# Altium project F1C200s-core.PrjPcb
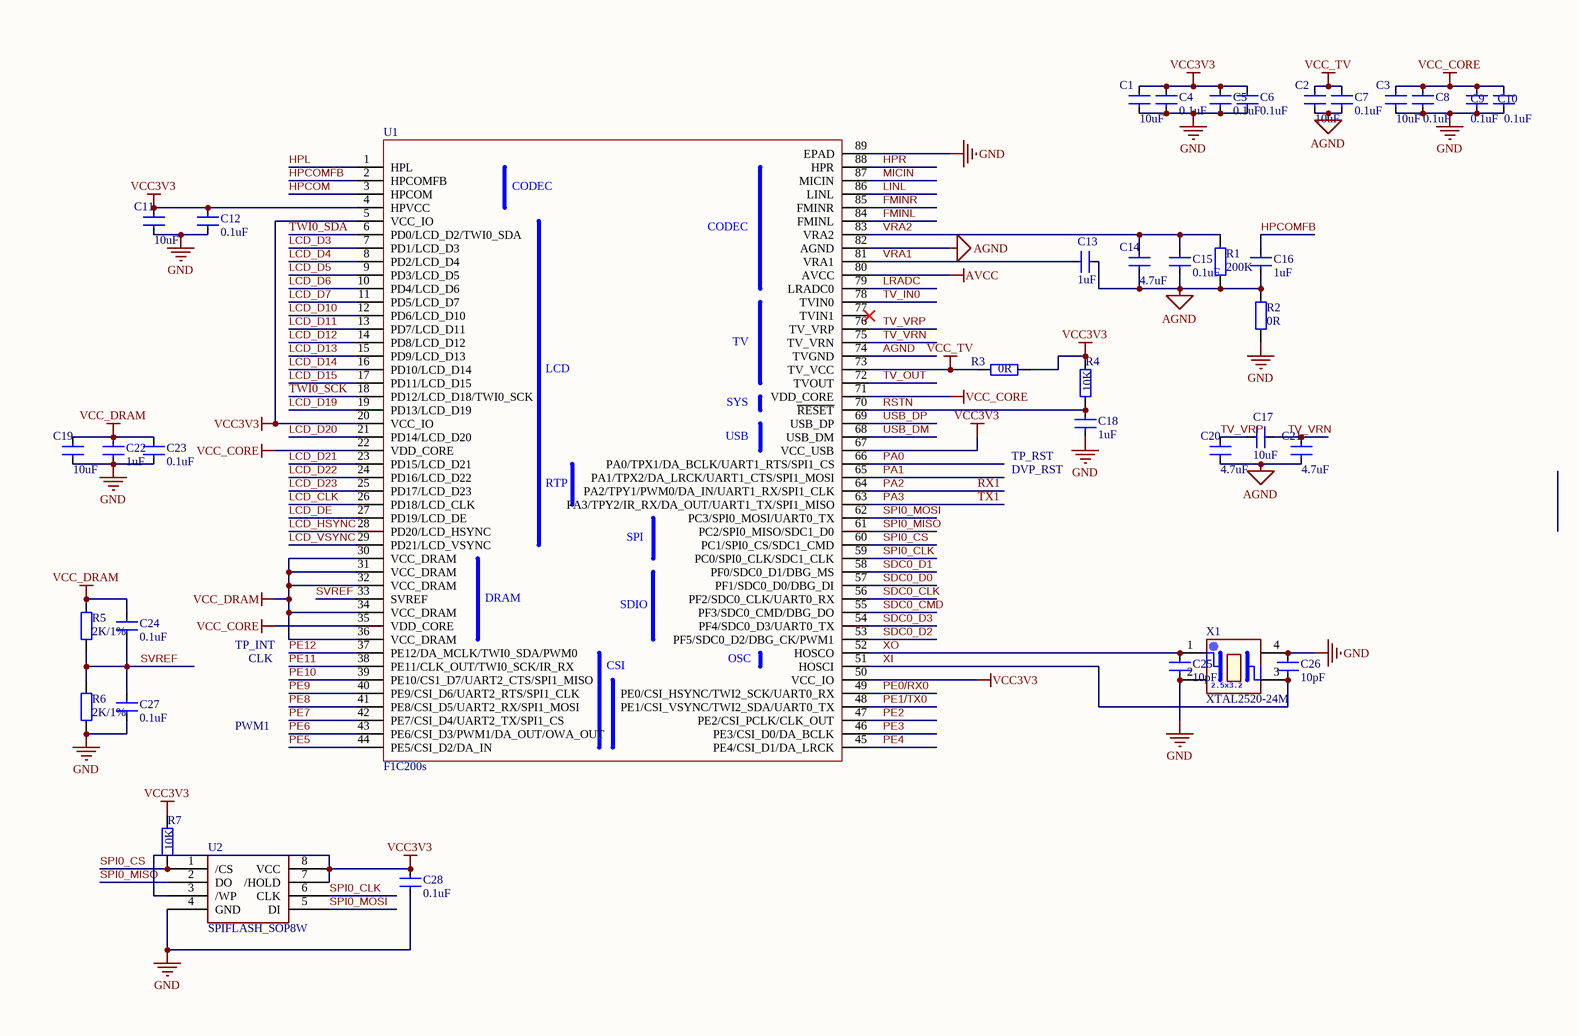
[diagram p0: F200s.SchDoc]
2 sheets, 112 parts. Net scope: global (net labels, ports and power ports of the same name join across sheets).
Board file: core.PcbDoc
Sheets:
  F200s.SchDoc
  Periph.SchDoc

## Sheet F200s.SchDoc: RF
size A4; Date: 20150330; DrawnBy: mango; DocumentNumber: 1; SheetNumber: 1; SheetTotal: 7; CurrentTime: sdfsdfsd

### Parts
C1  10uF  [C0402]
C2  10uF  [C0402]
C3  10uF  [C0402]
C4  0.1uF  [C0402]
C5  0.1uF  [C0402]
C6  0.1uF  [C0402]
C7  0.1uF  [C0402]
C8  0.1uF  [C0402]
C9  0.1uF  [C0402]
C10  0.1uF  [C0402]
C11  10uF  [C0402]
C12  0.1uF  [C0402]
C13  1uF  [C0402]
C14  4.7uF  [C0402]
C15  0.1uF  [C0402]
C16  1uF  [C0402]
C17  10uF  [C0402]
C18  1uF  [C0402]
C19  10uF  [C0402]
C20  4.7uF  [C0402]
C21  4.7uF  [C0402]
C22  1uF  [C0402]
C23  0.1uF  [C0402]
C24  0.1uF  [C0402]
C25  10pF  [C0402]
C26  10pF  [C0402]
C27  0.1uF  [C0402]
C28  0.1uF  [C0402]
R1  200K  [R0402]
R2  0R  [R0402]
R3  0R  [R0402]
R4  10K  [R0402]
R5  2K/1%  [R0402]
R6  2K/1%  [R0402]
R7  10K  [R0402]
U1  F1C200s  [QFN40P1000X1000X85_HS-89N]
U2  SPIFLASH_SOP8W  [WSON-SPIFLASH]
X1  XTAL2520-24M  [XTAL2520]

### Nets
AGND: C2.1 C7.1 C13.2 C14.1 C15.1 C16.2 C20.1 C21.1 R1.1 R2.2 U1.74(TVGND) U1.82(AGND)
AVCC: U1.80(AVCC)
GND: C1.1 C3.1 C4.1 C5.1 C6.1 C8.1 C9.1 C10.1 C11.1 C12.2 C18.2 C19.1 C22.1 C23.1 C25.1 C26.2 C27.1 C28.1 R2.1 R6.1 U1.89(EPAD) U2.4(GND) X1.2(NC1) X1.4(NC2)
VCC3V3: C1.2 C4.2 C5.2 C6.2 C11.2 C12.1 C28.2 R3.1 R4.2 R7.2 U1.4(HPVCC) U1.5(VCC_IO) U1.20(VCC_IO) U1.50(VCC_IO) U1.67(VCC_USB) U2.3(/WP) U2.7(/HOLD) U2.8(VCC)
VCC_CORE: C3.2 C8.2 C9.2 C10.2 U1.22(VDD_CORE) U1.35(VDD_CORE) U1.71(VDD_CORE)
VCC_DRAM: C19.2 C22.2 C23.2 C24.2 R5.2 U1.30(VCC_DRAM) U1.31(VCC_DRAM) U1.32(VCC_DRAM) U1.34(VCC_DRAM) U1.36(VCC_DRAM)
VCC_TV: C2.2 C7.2 R3.2 U1.73(TV_VCC)
FMINL: U1.84(FMINL)
FMINR: U1.85(FMINR)
HPCOM: U1.3(HPCOM)
HPCOMFB: C16.1 U1.2(HPCOMFB)
HPL: U1.1(HPL)
HPR: U1.88(HPR)
LCD_CLK: U1.26(PD18/LCD_CLK)
LCD_D3: U1.7(PD1/LCD_D3)
LCD_D4: U1.8(PD2/LCD_D4)
LCD_D5: U1.9(PD3/LCD_D5)
LCD_D6: U1.10(PD4/LCD_D6)
LCD_D7: U1.11(PD5/LCD_D7)
LCD_D10: U1.12(PD6/LCD_D10)
LCD_D11: U1.13(PD7/LCD_D11)
LCD_D12: U1.14(PD8/LCD_D12)
LCD_D13: U1.15(PD9/LCD_D13)
LCD_D14: U1.16(PD10/LCD_D14)
LCD_D15: U1.17(PD11/LCD_D15)
LCD_D19: U1.19(PD13/LCD_D19)
LCD_D20: U1.21(PD14/LCD_D20)
LCD_D21: U1.23(PD15/LCD_D21)
LCD_D22: U1.24(PD16/LCD_D22)
LCD_D23: U1.25(PD17/LCD_D23)
LCD_DE: U1.27(PD19/LCD_DE)
LCD_HSYNC: U1.28(PD20/LCD_HSYNC)
LCD_VSYNC: U1.29(PD21/LCD_VSYNC)
LINL: U1.86(LINL)
LRADC: U1.79(LRADC0)
MICIN: U1.87(MICIN)
PA0: U1.66(PA0/TPX1/DA_BCLK/UART1_RTS/SPI1_CS)
PA1: U1.65(PA1/TPX2/DA_LRCK/UART1_CTS/SPI1_MOSI)  [project net DVP_RST]
PA2: U1.64(PA2/TPY1/PWM0/DA_IN/UART1_RX/SPI1_CLK)  [also labelled RX1]
PA3: U1.63(PA3/TPY2/IR_RX/DA_OUT/UART1_TX/SPI1_MISO)  [also labelled TX1]
PE0/RX0: U1.49(PE0/CSI_HSYNC/TWI2_SCK/UART0_RX)  [project net DVP_HSYNC]
PE1/TX0: U1.48(PE1/CSI_VSYNC/TWI2_SDA/UART0_TX)  [project net DVP_VSYNC]
PE2: U1.47(PE2/CSI_PCLK/CLK_OUT)  [project net DVP_PCLK]
PE3: U1.46(PE3/CSI_D0/DA_BCLK)  [project net DVP-Y2]
PE4: U1.45(PE4/CSI_D1/DA_LRCK)  [project net DVP-Y3]
PE5: U1.44(PE5/CSI_D2/DA_IN)  [project net DVP-Y4]
PE6: U1.43(PE6/CSI_D3/PWM1/DA_OUT/OWA_OUT)  [project net DVP-Y5]
PE7: U1.42(PE7/CSI_D4/UART2_TX/SPI1_CS)  [project net DVP-Y6]
PE8: U1.41(PE8/CSI_D5/UART2_RX/SPI1_MOSI)  [project net DVP-Y7]
PE9: U1.40(PE9/CSI_D6/UART2_RTS/SPI1_CLK)  [project net DVP-Y8]
PE10: U1.39(PE10/CS1_D7/UART2_CTS/SPI1_MISO)  [project net DVP-Y9]
PE11: U1.38(PE11/CLK_OUT/TWI0_SCK/IR_RX)  [project net DVP_XCLK]
PE12: U1.37(PE12/DA_MCLK/TWI0_SDA/PWM0)
RSTN: C18.1 R4.1 U1.70(~{RESET})
SDC0_CLK: U1.56(PF2/SDC0_CLK/UART0_RX)
SDC0_CMD: U1.55(PF3/SDC0_CMD/DBG_DO)
SDC0_D0: U1.57(PF1/SDC0_D0/DBG_DI)
SDC0_D1: U1.58(PF0/SDC0_D1/DBG_MS)
SDC0_D2: U1.53(PF5/SDC0_D2/DBG_CK/PWM1)
SDC0_D3: U1.54(PF4/SDC0_D3/UART0_TX)
SPI0_CLK: U1.59(PC0/SPI0_CLK/SDC1_CLK) U2.6(CLK)
SPI0_CS: R7.1 U1.60(PC1/SPI0_CS/SDC1_CMD) U2.1(/CS)
SPI0_MISO: U1.61(PC2/SPI0_MISO/SDC1_D0) U2.2(DO)
SPI0_MOSI: U1.62(PC3/SPI0_MOSI/UART0_TX) U2.5(DI)
SVREF: C24.1 C27.2 R5.1 R6.2 U1.33(SVREF)
TV_IN0: U1.78(TVIN0)
TV_OUT: U1.72(TVOUT)
TV_VRN: C17.1 C21.2 U1.75(TV_VRN)
TV_VRP: C17.2 C20.2 U1.76(TV_VRP)
TWI0_SCK: U1.18(PD12/LCD_D18/TWI0_SCK)  [project net DVP_SCL]
TWI0_SDA: U1.6(PD0/LCD_D2/TWI0_SDA)  [project net DVP_SDA]
USB_DM: U1.68(USB_DM)
USB_DP: U1.69(USB_DP)
VRA1: C13.1 U1.81(VRA1)
VRA2: C14.2 C15.2 R1.2 U1.83(VRA2)
XI: C26.1 U1.51(HOSCI) X1.3(X2)
XO: C25.2 U1.52(HOSCO) X1.1(X1)

Not connected (* = marked no-connect by the designer): U1 77(TVIN1)*

### Notes on the sheet
- (near C18) DVP_RST
- TP_RST
- TP_INT
- CLK
- PWM1
- (in symbol F1C200s) CODEC; TV; LCD; SYS; USB; RTP; SPI; DRAM; SDIO; OSC; CSI
- (in symbol XTAL3225) 2.5x3.2

### Library data of the parts
C1-C28 = CAP: 普通小电容
R1-R7 = RES: 普通电阻
X1 = XTAL3225

## Sheet Periph.SchDoc
size A3; DocumentNumber: 3; SheetNumber: 3; SheetTotal: 7
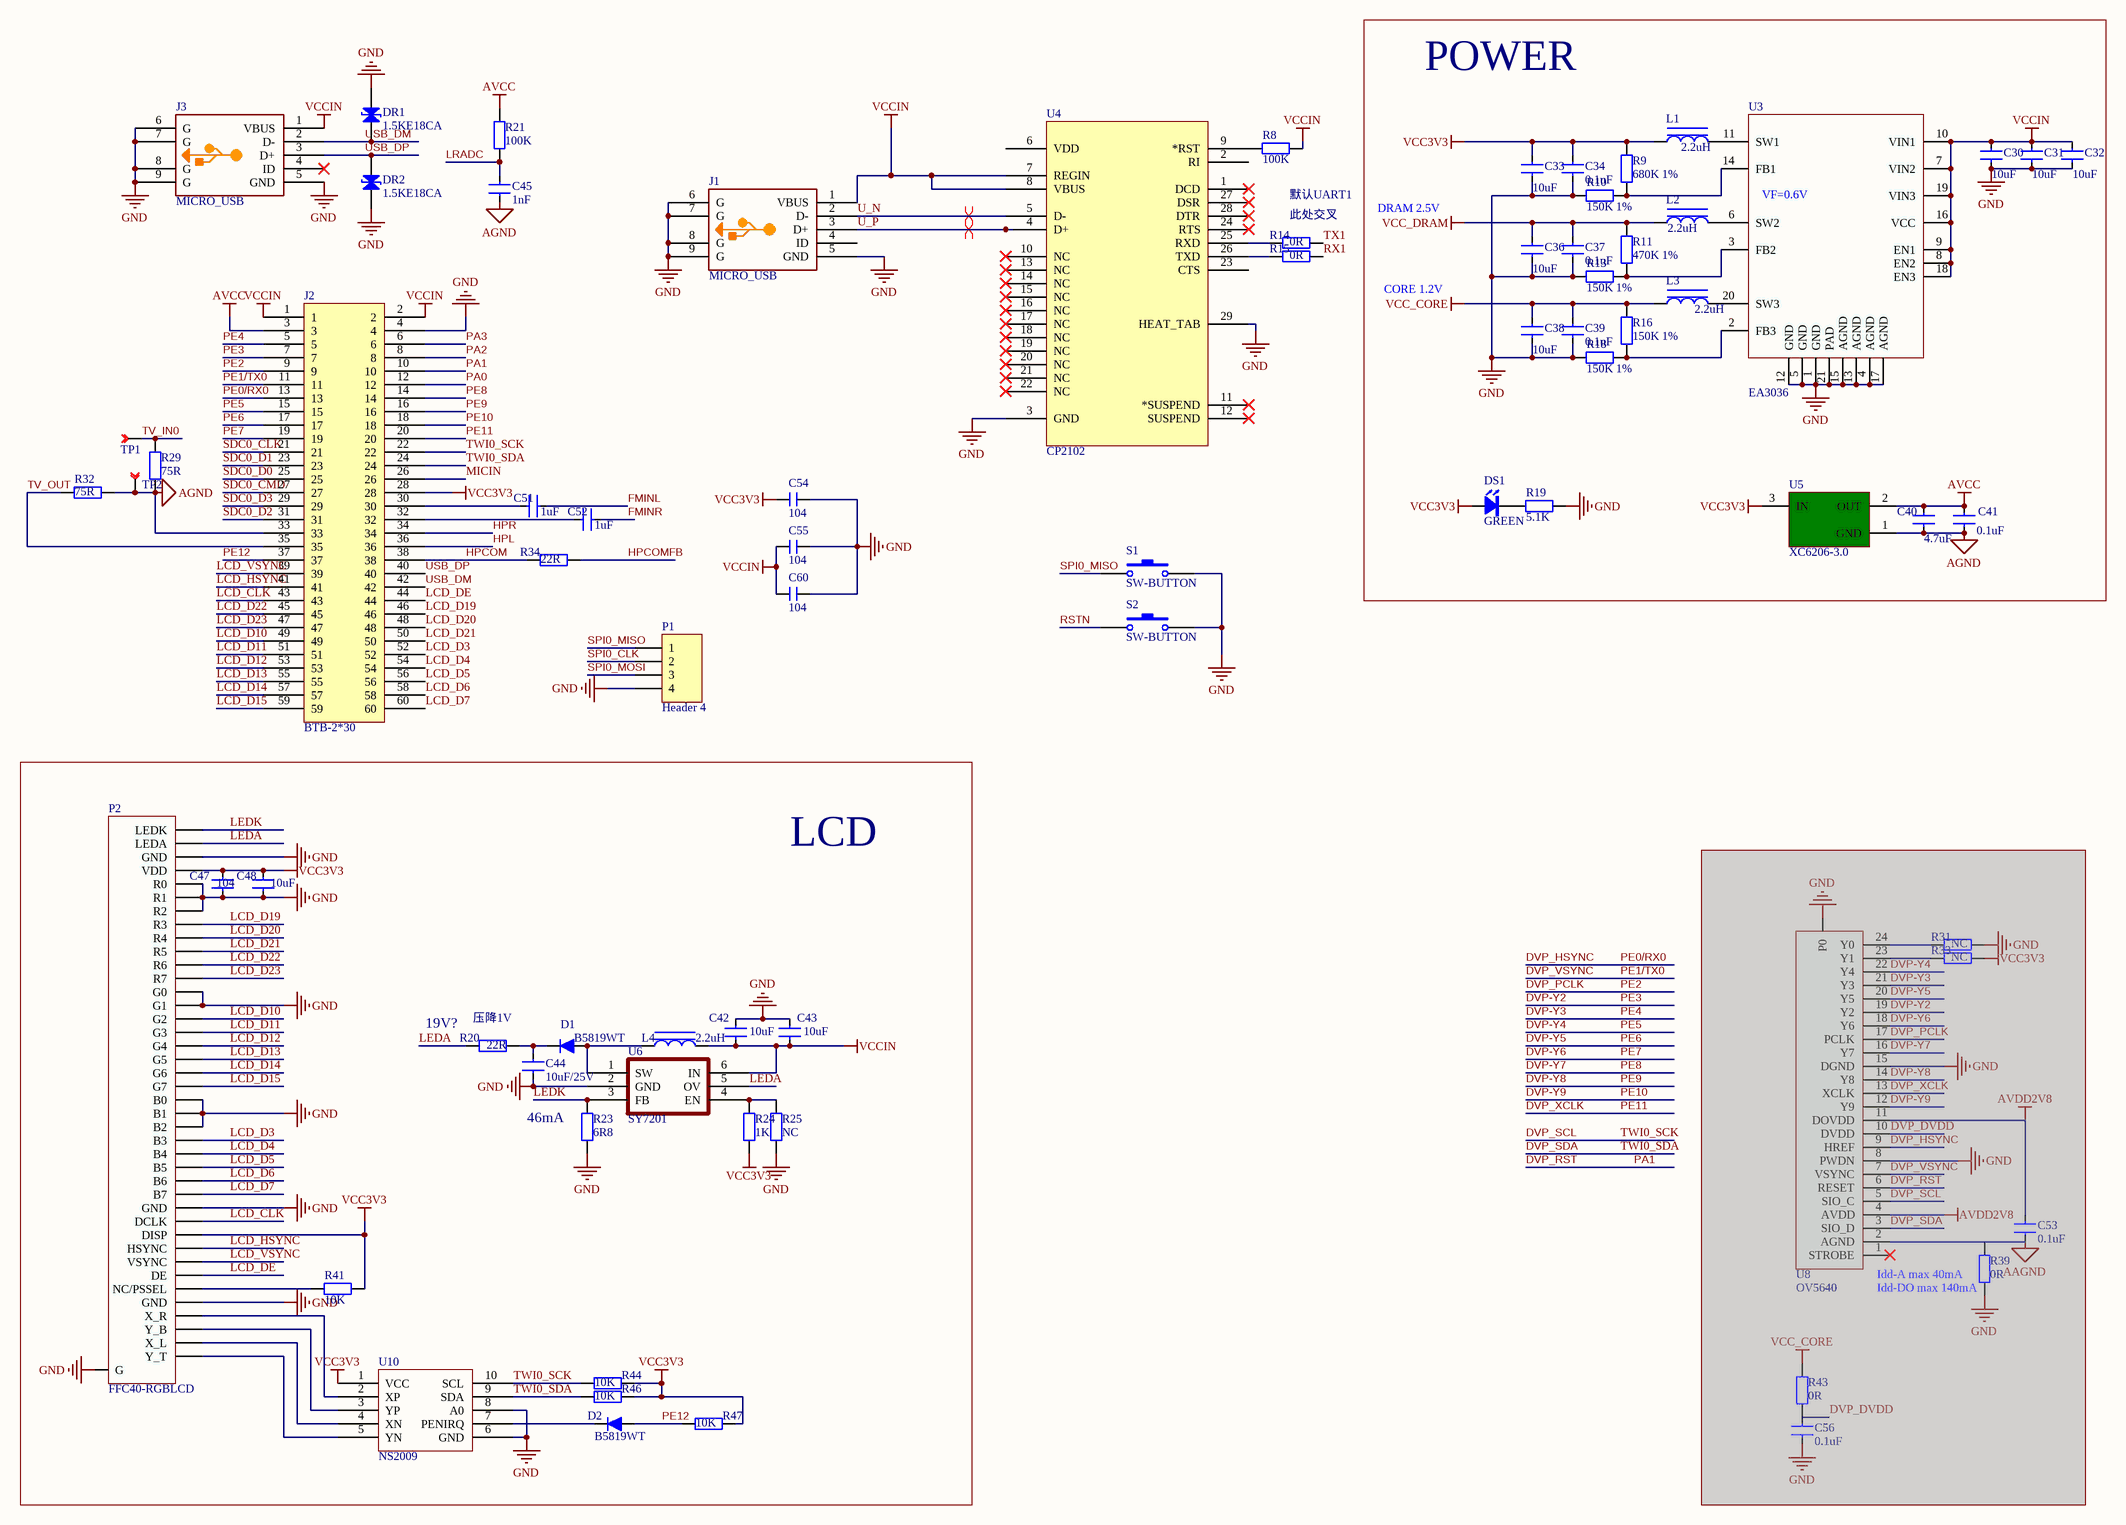
[diagram p1: Periph.SchDoc]

### Parts
C30  10uF  [C0402]
C31  10uF  [C0402]
C32  10uF  [C0402]
C33  10uF  [C0402]
C34  0.1uF  [C0402]
C36  10uF  [C0402]
C37  0.1uF  [C0402]
C38  10uF  [C0402]
C39  0.1uF  [C0402]
C40  4.7uF  [C0402]
C41  0.1uF  [C0402]
C42  10uF  [C0402]
C43  10uF  [C0402]
C44  10uF/25V  [C0402]
C45  1nF  [C0402]
C47  104  [C0402]
C48  10uF  [C0402]
C51  1uF  [C0402]
C52  1uF  [C0402]
C53  0.1uF  [C0402]  (masked out: inside a compile mask, not in the netlist)
C54  104  [C 1206_L]
C55  104  [C 1206_L]
C56  0.1uF  [C0402]  (masked out: inside a compile mask, not in the netlist)
C60  104  [C 1206_L]
D1  B5819WT  [SOD523]
D2  B5819WT  [SOD523]
DR1  1.5KE18CA  [C 0805_L]
DR2  1.5KE18CA  [C 0805_L]
DS1  GREEN  [LED0402]
J1  MICRO_USB  [MICROUSB-youxin]
J2  BTB-2*30  [CONN-SMD_BA41-60AT-1-ZHB]
J3  MICRO_USB  [MICROUSB-youxin]
L1  2.2uH  [VLS2016]
L2  2.2uH  [VLS2016]
L3  2.2uH  [VLS2016]
L4  2.2uH  [VLS3012E]
P1  Header 4  [HDR1X4]
P2  FFC40-RGBLCD  [FFC/SM0.5-1H40]
R8  100K  [R 0402_M]
R9  680K 1%  [R0402]
R10  150K 1%  [R0402]
R11  470K 1%  [R0402]
R13  150K 1%  [R0402]
R14  0R  [R0402]
R15  0R  [R0402]
R16  150K 1%  [R0402]
R18  150K 1%  [R0402]
R19  5.1K  [R0402]
R20  22R  [R0603]
R21  100K  [R0402]
R23  6R8  [R0402]
R24  1K  [R0402]
R25  NC  [R0402]
R29  75R  [R0402]
R31  NC  [R0402]  (masked out: inside a compile mask, not in the netlist)
R32  75R  [R0402]
R33  NC  [R0402]  (masked out: inside a compile mask, not in the netlist)
R34  22R  [R0402]
R39  0R  [R0402]  (masked out: inside a compile mask, not in the netlist)
R41  10K  [R0402]
R43  0R  [R0402]  (masked out: inside a compile mask, not in the netlist)
R44  10K  [R0402]
R46  10K  [R0402]
R47  10K  [R0402]
S1  SW-BUTTON  [MINIBUTTON]
S2  SW-BUTTON  [MINIBUTTON]
TP1  TEST POINT  [TEST-POINT]  (value not drawn)
TP2  TEST POINT  [TEST-POINT]  (value not drawn)
U3  EA3036  [QFN40P300X300X80_HS-21N]
U4  CP2102  [QFN28 5x5_N]
U5  XC6206-3.0  [SOT23]
U6  SY7201  [SOT23-6]
U8  OV5640  [FFC/SM0.5-1H24 - OV2640]  (masked out: inside a compile mask, not in the netlist)
U10  NS2009  [TSSOP10]

### Blocks framed on the sheet
POWER: C30-C34 C36-C41 DS1 L1-L3 R9-R11 R13 R16 R18 R19 U3 U5
LCD: C42-C44 C47 C48 D1 D2 L4 P2 R20 R23-R25 R41 R44 R46 R47 U6 U10

### Nets
AGND: C40.1 C41.1 C45.1 J2.33 R29.2 R32.2 TP2.1 U5.1(GND)
AVCC: C40.2 C41.2 J2.3 R21.2 U5.2(OUT)
GND: C30.2 C31.2 C32.2 C33.2 C34.1 C36.2 C37.1 C38.2 C39.1 C42.2 C43.1 C44.1 C47.2 C48.1 C54.2 C55.2 C60.2 DR1.1(A) DR2.2(K) J1.5(GND) J1.6(G) J1.7(G) J1.8(G) J1.9(G) J2.4 J3.5(GND) J3.6(G) J3.7(G) J3.8(G) J3.9(G) P1.4 P2.3(GND) P2.5(R0) P2.6(R1) P2.7(R2) P2.13(G0) P2.14(G1) P2.21(B0) P2.22(B1) P2.23(B2) P2.29(GND) P2.36(GND) P2.G R10.2 R13.2 R18.2 R19.2 R23.1 R25.2 S1.2 S2.2 U3.1(GND) U3.4(AGND) U3.5(GND) U3.12(GND) U3.13(AGND) U3.15(AGND) U3.17(AGND) U3.21(PAD) U4.3(GND) U4.29(HEAT_TAB) U6.2(GND) U10.6(GND) U10.8(A0)
VCC3V3: C33.1 C34.2 C47.1 C48.2 C54.1 DS1.A J2.28 L1.2 P2.4(VDD) P2.31(DISP) R9.1 R24.1 R41.1 R44.2 R46.2 R47.2 U5.3(IN) U10.1(VCC)
VCC_CORE: C38.1 C39.2 L3.2 R16.1
VCC_DRAM: C36.1 C37.2 L2.2 R11.1
VCCIN: C30.1 C31.1 C32.1 C42.1 C43.2 C55.1 C60.1 J1.1(VBUS) J2.1 J2.2 J3.1(VBUS) L4.1 R8.1 U3.7(VIN2) U3.8(EN2) U3.9(EN1) U3.10(VIN1) U3.16(VCC) U3.18(EN3) U3.19(VIN3) U4.7(REGIN) U4.8(VBUS) U6.6(IN)
DVP-Y2: J2.7  [also labelled PE3]
DVP-Y3: J2.5  [also labelled PE4]
DVP-Y4: J2.15  [also labelled PE5]
DVP-Y5: J2.17  [also labelled PE6]
DVP-Y6: J2.19  [also labelled PE7]
DVP-Y7: J2.14  [also labelled PE8]
DVP-Y8: J2.16  [also labelled PE9]
DVP-Y9: J2.18  [also labelled PE10]
DVP_HSYNC: J2.13  [also labelled PE0/RX0]
DVP_PCLK: J2.9  [also labelled PE2]
DVP_RST: J2.10  [also labelled PA1]
DVP_SCL: J2.22 R44.1 U10.10(SCL)  [also labelled TWI0_SCK]
DVP_SDA: J2.24 R46.1 U10.9(SDA)  [also labelled TWI0_SDA]
DVP_VSYNC: J2.11  [also labelled PE1/TX0]
DVP_XCLK: J2.20  [also labelled PE11]
FMINL: C51.2
FMINR: C52.2
HPCOM: J2.38 R34.1
HPCOMFB: R34.2
HPL: J2.36
HPR: J2.34
LCD_CLK: J2.43 P2.30(DCLK)
LCD_D3: J2.52 P2.24(B3)
LCD_D4: J2.54 P2.25(B4)
LCD_D5: J2.56 P2.26(B5)
LCD_D6: J2.58 P2.27(B6)
LCD_D7: J2.60 P2.28(B7)
LCD_D10: J2.49 P2.15(G2)
LCD_D11: J2.51 P2.16(G3)
LCD_D12: J2.53 P2.17(G4)
LCD_D13: J2.55 P2.18(G5)
LCD_D14: J2.57 P2.19(G6)
LCD_D15: J2.59 P2.20(G7)
LCD_D19: J2.46 P2.8(R3)
LCD_D20: J2.48 P2.9(R4)
LCD_D21: J2.50 P2.10(R5)
LCD_D22: J2.45 P2.11(R6)
LCD_D23: J2.47 P2.12(R7)
LCD_DE: J2.44 P2.34(DE)
LCD_HSYNC: J2.41 P2.32(HSYNC)
LCD_VSYNC: J2.39 P2.33(VSYNC)
LEDA: P2.2(LEDA) R20.2 U6.5(OV)
LEDK: P2.1(LEDK) R23.2 U6.3(FB)
LRADC: C45.2 R21.1
MICIN: J2.26
PA0: J2.12
PA2: J2.8 R15.1  [also labelled RX1]
PA3: J2.6 R14.1  [also labelled TX1]
PE12: D2.A J2.37 R47.1
RSTN: S2.1
SDC0_CLK: J2.21
SDC0_CMD: J2.27
SDC0_D0: J2.25
SDC0_D1: J2.23
SDC0_D2: J2.31
SDC0_D3: J2.29
SPI0_CLK: P1.2
SPI0_MISO: P1.1 S1.1
SPI0_MOSI: P1.3
TV_IN0: R29.1 TP1.1
TV_OUT: J2.35 R32.1
U_N: J1.2(D-) U4.5(D-)
U_P: J1.3(D+) U4.4(D+)
USB_DM: DR1.2(K) J2.42 J3.2(D-)
USB_DP: DR2.1(A) J2.40 J3.3(D+)
NetC44_2: C44.2 D1.K R20.1
NetC51_1: C51.1 J2.30
NetC52_1: C52.1 J2.32
NetD1_A: D1.A L4.2 U6.1(SW)
NetD2_K: D2.K U10.7(PENIRQ)
NetDS1_K: DS1.K R19.1
NetL1_1: L1.1 U3.11(SW1)
NetL2_1: L2.1 U3.6(SW2)
NetL3_1: L3.1 U3.20(SW3)
NetP2_35: P2.35(NC/PSSEL) R41.2
NetP2_37: P2.37(X_R) U10.2(XP)
NetP2_38: P2.38(Y_B) U10.3(YP)
NetP2_39: P2.39(X_L) U10.4(XN)
NetP2_40: P2.40(Y_T) U10.5(YN)
NetR8_2: R8.2 U4.9(*RST)
NetR9_2: R9.2 R10.1 U3.14(FB1)
NetR11_2: R11.2 R13.1 U3.3(FB2)
NetR14_2: R14.2 U4.25(RXD)
NetR15_2: R15.2 U4.26(TXD)
NetR16_2: R16.2 R18.1 U3.2(FB3)
NetR24_2: R24.2 R25.1 U6.4(EN)

Not connected (* = marked no-connect by the designer): J1 4(ID); J3 4(ID)*; U4 1(DCD)* 2(RI) 6(VDD) 10(NC)* 11(*SUSPEND)* 12(SUSPEND)* 13(NC)* 14(NC)* 15(NC)* 16(NC)* 17(NC)* 18(NC)* 19(NC)* 20(NC)* 21(NC)* 22(NC)* 23(CTS) 24(RTS)* 27(DSR)* 28(DTR)*

### Layout directives
differential pair: U_N, U_P

### Notes on the sheet
- 默认UART1
- (near U3) VF=0.6V
- 此处交叉
- DRAM 2.5V
- CORE 1.2V
- (near R20) 19V?
- (near R20) 压降1V
- 46mA
- Idd-A max 40mA
- (near R39) Idd-DO max 140mA

### Library data of the parts
C30-C34 C36-C45 C47 C48 C51-C53 C56 = CAP: 普通小电容
C54 C55 C60 = C: 无极性贴片电容; 版权归属: 源创客; 材质: X7R; BOM名称: 无极性贴片电容; 学习资源: www.ooocke.com
D1 D2 = Diode: 普通二极管
DR1 DR2 = DR: 瞬态电压抑制二极管; 版权归属: 源创客; BOM名称: 瞬态电压抑制二极管; 学习资源: www.ooocke.com
DS1 = LED
J2 = BTB-2*30PIN: 连接器
L1-L4 = L: 普通电感
P1 = Header 4: Header, 4-Pin; LatestRevisionDate: 17-Jul-2002; LatestRevisionNote: Re-released for DXP Platform.; Publisher: Altium Limited
R8-R11 R13-R16 R18 R20 R21 R23-R25 R29 R31-R34 R39 R41 R43 R44 R46 R47 = RES: 普通电阻
R19 = RES: 普通电阻1%精度
TP1 TP2 = TP: Description
U4 = CP2102: USB转TTL; PART DESC: SINGLE-CHIP USB TO UART BRIDGE, QFN28, RoHS.; MFG #1: SILICON LABS; PART NUMBER: CP2102; Value: Value; RefDes: RefDes; Type: DEV
U5 = XC6206
U6 = PT4101
U8 = OV5640: Header, 24-Pin; LatestRevisionDate: 17-Jul-2002; LatestRevisionNote: Re-released for DXP Platform.; Publisher: Altium Limited
P2 = FFC40-RGBLCD: LatestRevisionDate: 17-Jul-2002; LatestRevisionNote: Re-released for DXP Platform.; Publisher: Altium Limited

## Nets that join several sheets
AGND: F200s (12 pins), Periph (8 pins)
AVCC: F200s (U1.80), Periph (5 pins)
GND: F200s (24 pins), Periph (64 pins)
VCC3V3: F200s (18 pins), Periph (18 pins)
VCC_CORE: F200s (7 pins), Periph (C38.1 C39.2 L3.2 R16.1)
VCC_DRAM: F200s (10 pins), Periph (C36.1 C37.2 L2.2 R11.1)
DVP-Y2: F200s (U1.46), Periph (J2.7)
DVP-Y3: F200s (U1.45), Periph (J2.5)
DVP-Y4: F200s (U1.44), Periph (J2.15)
DVP-Y5: F200s (U1.43), Periph (J2.17)
DVP-Y6: F200s (U1.42), Periph (J2.19)
DVP-Y7: F200s (U1.41), Periph (J2.14)
DVP-Y8: F200s (U1.40), Periph (J2.16)
DVP-Y9: F200s (U1.39), Periph (J2.18)
DVP_HSYNC: F200s (U1.49), Periph (J2.13)
DVP_PCLK: F200s (U1.47), Periph (J2.9)
DVP_RST: F200s (U1.65), Periph (J2.10)
DVP_SCL: F200s (U1.18), Periph (J2.22 R44.1 U10.10)
DVP_SDA: F200s (U1.6), Periph (J2.24 R46.1 U10.9)
DVP_VSYNC: F200s (U1.48), Periph (J2.11)
DVP_XCLK: F200s (U1.38), Periph (J2.20)
FMINL: F200s (U1.84), Periph (C51.2)
FMINR: F200s (U1.85), Periph (C52.2)
HPCOM: F200s (U1.3), Periph (J2.38 R34.1)
HPCOMFB: F200s (C16.1 U1.2), Periph (R34.2)
HPL: F200s (U1.1), Periph (J2.36)
HPR: F200s (U1.88), Periph (J2.34)
LCD_CLK: F200s (U1.26), Periph (J2.43 P2.30)
LCD_D3: F200s (U1.7), Periph (J2.52 P2.24)
LCD_D4: F200s (U1.8), Periph (J2.54 P2.25)
LCD_D5: F200s (U1.9), Periph (J2.56 P2.26)
LCD_D6: F200s (U1.10), Periph (J2.58 P2.27)
LCD_D7: F200s (U1.11), Periph (J2.60 P2.28)
LCD_D10: F200s (U1.12), Periph (J2.49 P2.15)
LCD_D11: F200s (U1.13), Periph (J2.51 P2.16)
LCD_D12: F200s (U1.14), Periph (J2.53 P2.17)
LCD_D13: F200s (U1.15), Periph (J2.55 P2.18)
LCD_D14: F200s (U1.16), Periph (J2.57 P2.19)
LCD_D15: F200s (U1.17), Periph (J2.59 P2.20)
LCD_D19: F200s (U1.19), Periph (J2.46 P2.8)
LCD_D20: F200s (U1.21), Periph (J2.48 P2.9)
LCD_D21: F200s (U1.23), Periph (J2.50 P2.10)
LCD_D22: F200s (U1.24), Periph (J2.45 P2.11)
LCD_D23: F200s (U1.25), Periph (J2.47 P2.12)
LCD_DE: F200s (U1.27), Periph (J2.44 P2.34)
LCD_HSYNC: F200s (U1.28), Periph (J2.41 P2.32)
LCD_VSYNC: F200s (U1.29), Periph (J2.39 P2.33)
LRADC: F200s (U1.79), Periph (C45.2 R21.1)
MICIN: F200s (U1.87), Periph (J2.26)
PA0: F200s (U1.66), Periph (J2.12)
PA2: F200s (U1.64), Periph (J2.8 R15.1)
PA3: F200s (U1.63), Periph (J2.6 R14.1)
PE12: F200s (U1.37), Periph (D2.A J2.37 R47.1)
RSTN: F200s (C18.1 R4.1 U1.70), Periph (S2.1)
SDC0_CLK: F200s (U1.56), Periph (J2.21)
SDC0_CMD: F200s (U1.55), Periph (J2.27)
SDC0_D0: F200s (U1.57), Periph (J2.25)
SDC0_D1: F200s (U1.58), Periph (J2.23)
SDC0_D2: F200s (U1.53), Periph (J2.31)
SDC0_D3: F200s (U1.54), Periph (J2.29)
SPI0_CLK: F200s (U1.59 U2.6), Periph (P1.2)
SPI0_MISO: F200s (U1.61 U2.2), Periph (P1.1 S1.1)
SPI0_MOSI: F200s (U1.62 U2.5), Periph (P1.3)
TV_IN0: F200s (U1.78), Periph (R29.1 TP1.1)
TV_OUT: F200s (U1.72), Periph (J2.35 R32.1)
USB_DM: F200s (U1.68), Periph (DR1.2 J2.42 J3.2)
USB_DP: F200s (U1.69), Periph (DR2.1 J2.40 J3.3)